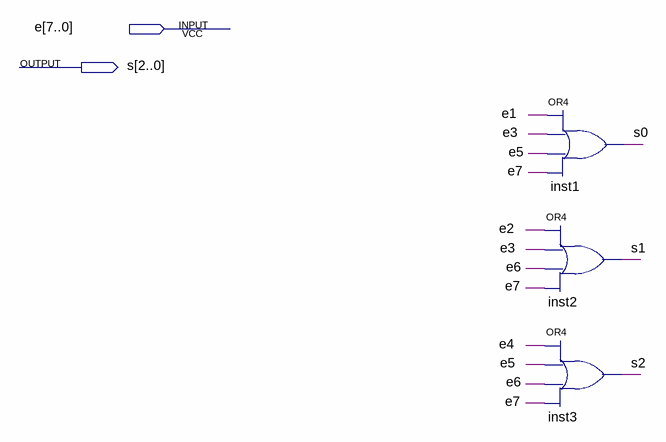
[diagram p0: schematic sheet]
// Quartus schematic CODER.bdf as structural Verilog: 3 symbols, 2 pins
module CODER (
  input  [7:0] e,
  output [2:0] s
);

  or inst1 (s[0], e[1], e[3], e[5], e[7]);
  or inst2 (s[1], e[2], e[3], e[6], e[7]);
  or inst3 (s[2], e[4], e[5], e[6], e[7]);
endmodule
